# EAGLE design redLED12Vfive (EAGLE 7.4.0)
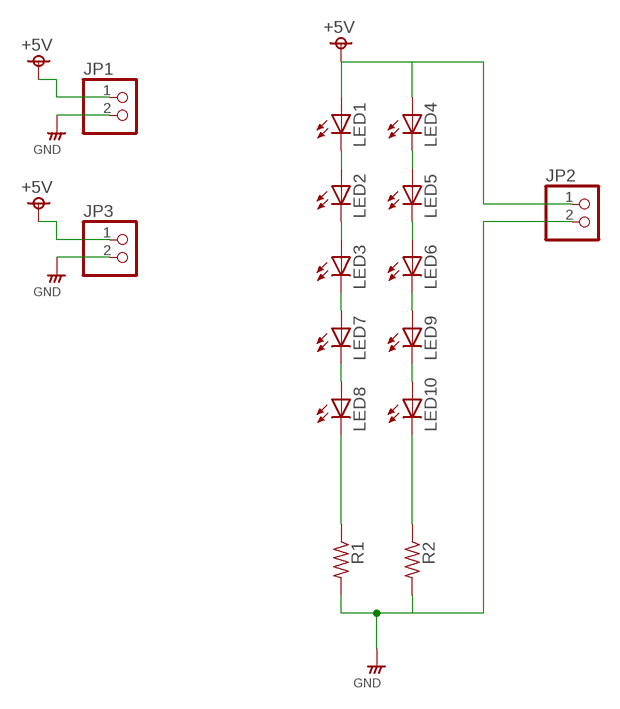
[diagram p0: schematic, sheet 1]

## Parts
JP1  PINHD-1X2"  [1*02]
JP2  PINHD-1X2"  [1*02]
JP3  PINHD-1X2"  [1*02]
LED1  LED5MM  [LED5MM]
LED2  LED5MM  [LED5MM]
LED3  LED5MM  [LED5MM]
LED4  LED5MM  [LED5MM]
LED5  LED5MM  [LED5MM]
LED6  LED5MM  [LED5MM]
LED7  LED5MM  [LED5MM]
LED8  LED5MM  [LED5MM]
LED9  LED5MM  [LED5MM]
LED10  LED5MM  [LED5MM]
R1  RESISTORS-3  [R_0.2]
R2  RESISTORS-3  [R_0.2]

## Nets
+5V: JP1.1 JP2.1 JP3.1 LED1.A LED4.A
GND: JP1.2 JP2.2 JP3.2 R1.2 R2.2
N$1: LED10.K(C) R2.1
N$2: LED8.K(C) R1.1
N$3: LED1.K(C) LED2.A
N$4: LED2.K(C) LED3.A
N$5: LED7.K(C) LED8.A
N$6: LED9.K(C) LED10.A
N$7: LED4.K(C) LED5.A
N$8: LED5.K(C) LED6.A
N$9: LED6.K(C) LED9.A
N$10: LED3.K(C) LED7.A

## Library data of the parts
JP1-JP3 = pinhead_s:PINHD-1X2: PIN HEADER
LED1-LED10 = LED_s:LED: LED OSRAM: - CHIPLED LG R971, LG N971, LY N971, LG Q971, LY Q971, LO R971, LY R971 LH N974, LH R974 LS Q976, LO Q976, LY Q976 LO Q996 - Hyper CHIPLED LW Q18S LB Q993, LB Q99A, LB R99A - SideLED LS A670, LO A670, LY A670, LG A670, LP A670 LB A673, LV A673, LT A673, LW A673 LH A674 LY A675 LS A676, LA A676, LO A676, LY A676, LW A676 LS A679, LY A679, LG A679 - Hyper Micro SIDELED® LS Y876, LA Y876, LO Y876, LY Y876 LT Y87S - SmartLED LW L88C, LW L88S LB L89C, LB L89S, LG L890 LS L89K, LO L89K, LY L89K LS L896, LA L896, LO L896, LY L896 - TOPLED LS T670, LO T670, LY T670, LG T670, LP T670 LSG T670, LSP T670, LSY T670, LOP T670, LYG T670 LG T671, LOG T671, LSG T671 LB T673, LV T673, LT T673, LW T673 LH T674 LS T676, LA T676, LO T676, LY T676, LB T676, LH T676, LSB T676, LW T676 LB T67C, LV T67C, LT T67C, LS T67K, LO T67K, LY T67K, LW E67C LS E67B, LA E67B, LO E67B, LY E67B, LB E67C, LV E67C, LT E67C LW T67C LS T679, LY T679, LG T679 LS T770, LO T770, LY T770, LG T770, LP T770 LB T773, LV T773, LT T773, LW T773 LH T774 LS E675, LA E675, LY E675, LS T675 LS T776, LA T776, LO T776, LY T776, LB T776 LHGB T686 LT T68C, LB T68C - Hyper Mini TOPLED® LB M676 - Mini TOPLED Santana® LG M470 LS M47K, LO M47K, LY M47K Source: http://www.osram.convergy.de - LUMILED® LXK2-PW12-R00, LXK2-PW12-S00, LXK2-PW14-U00, LXK2-PW14-V00 LXK2-PM12-R00, LXK2-PM12-S00, LXK2-PM14-U00 LXK2-PE12-Q00, LXK2-PE12-R00, LXK2-PE12-S00, LXK2-PE14-T00, LXK2-PE14-U00 LXK2-PB12-K00, LXK2-PB12-L00, LXK2-PB12-M00, LXK2-PB14-N00, LXK2-PB14-P00, LXK2-PB14-Q00 LXK2-PR12-L00, LXK2-PR12-M00, LXK2-PR14-Q00, LXK2-PR14-R00 LXK2-PD12-Q00, LXK2-PD12-R00, LXK2-PD12-S00 LXK2-PH12-R00, LXK2-PH12-S00 LXK2-PL12-P00, LXK2-PL12-Q00, LXK2-PL12-R00 Source: www.luxeon.com
R1 R2 = rcl__s:RESISTORS

## Board
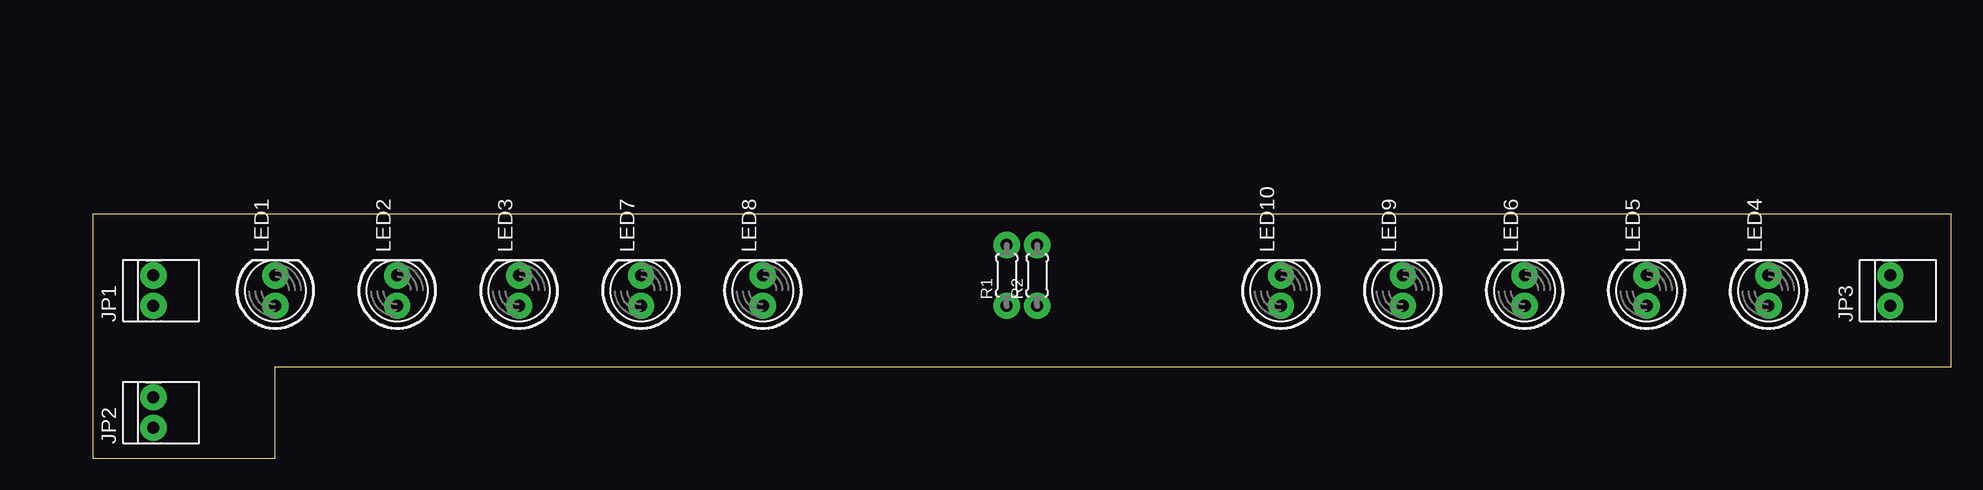
[diagram p1: board, top side]
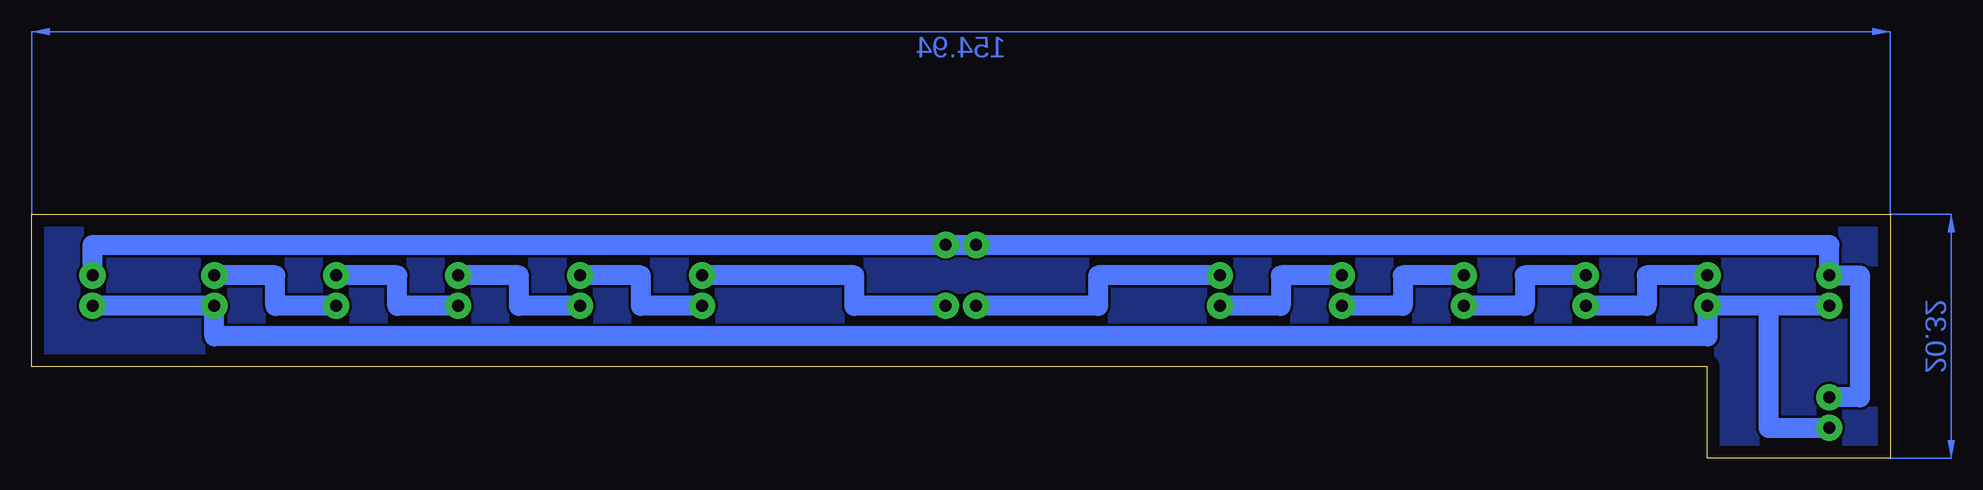
[diagram p2: board, bottom side, seen from below]

Size 154.92 x 20.32 mm. Coordinates in mm from the lower left corner, seen from the top.
Outline: 0,20.32 0,0.02 0.02,0 15.24,0 15.24,7.62 134.62,7.62 154.91,7.64 154.91,20.32 0,20.32
Copper layers (1*16): Top 0.035mm / dielectric 1.5mm / Bottom 0.035mm
Design rules "default": minimum track width 10mil, minimum drill 24mil, track to track 8mil, track to pad 8mil, pad to pad 8mil, via to via 8mil, smd to smd 8mil, copper to edge 40mil, drill to drill 8mil, minimum pad ring 10mil, minimum via ring 8mil, stop-mask expansion 4mil, vias tented up to drill 0mil, thermal gap 10mil

### Footprints (pad centres in the part's own frame; a part is rotated, then mirrored left to right if it is on the bottom)
1*02 = drill 1 pad 2.184: 1 -1.27,0; 2 1.27,0
LED5MM = drill 1 pad 2.184: A -1.27,0; K 1.27,0
R_0.2 = drill 1 pad 2.184: 1 -2.54,0; 2 2.54,0

### Placement (x,y rotation side)
JP1  5.08,13.97 90 top
JP2  5.08,3.81 90 top
JP3  149.86,13.97 90 top
LED1  15.24,13.97 90 top
LED2  25.4,13.97 90 top
LED3  35.56,13.97 90 top
LED4  139.7,13.97 90 top
LED5  129.54,13.97 90 top
LED6  119.38,13.97 90 top
LED7  45.72,13.97 90 top
LED8  55.88,13.97 90 top
LED9  109.22,13.97 90 top
LED10  99.06,13.97 90 top
R1  76.2,15.24 90 top
R2  78.74,15.24 90 top

### Tracks (layer width: path | path; a pad name or v marks a point on that pad's centre or on a via)
+5V
  Bottom 1.676: JP1.1 10.16,12.7 | 10.16,12.7 LED1.A 15.24,10.16 139.7,10.16 LED4.A JP3.1 | 10.16,12.7 10.16,2.54 JP2.1
GND
  Bottom 1.676: JP3.2 149.86,17.78 R2.2 R1.2 5.08,17.78 JP1.2 2.54,15.24 2.54,5.08 JP2.2
N$1
  Bottom 1.676: R2.1 86.36,12.7 86.36,15.24 LED10.K
N$2
  Bottom 1.676: LED8.K 66.04,15.24 66.04,12.7 R1.1
N$3
  Bottom 1.676: LED1.K 20.32,15.24 20.32,12.7 LED2.A
N$4
  Bottom 1.676: LED2.K 30.48,15.24 30.48,12.7 LED3.A
N$5
  Bottom 1.676: LED7.K 50.8,15.24 50.8,12.7 LED8.A
N$6
  Bottom 1.676: LED10.A 104.14,12.7 104.14,15.24 LED9.K
N$7
  Bottom 1.676: LED5.A 134.62,12.7 134.62,15.24 LED4.K
N$8
  Bottom 1.676: LED6.A 124.46,12.7 124.46,15.24 LED5.K
N$9
  Bottom 1.676: LED9.A 114.3,12.7 114.3,15.24 LED6.K
N$10
  Bottom 1.676: LED3.K 40.64,15.24 40.64,12.7 LED7.A
N$11
  pour Bottom: 154.94,20.32 0,20.32 0,0 15.24,0 15.24,7.62 154.94,7.62
(copper drawn outside any net)
  shapes: Bottom area x2